# EAGLE design board 2.1 (EAGLE 9.6.2)
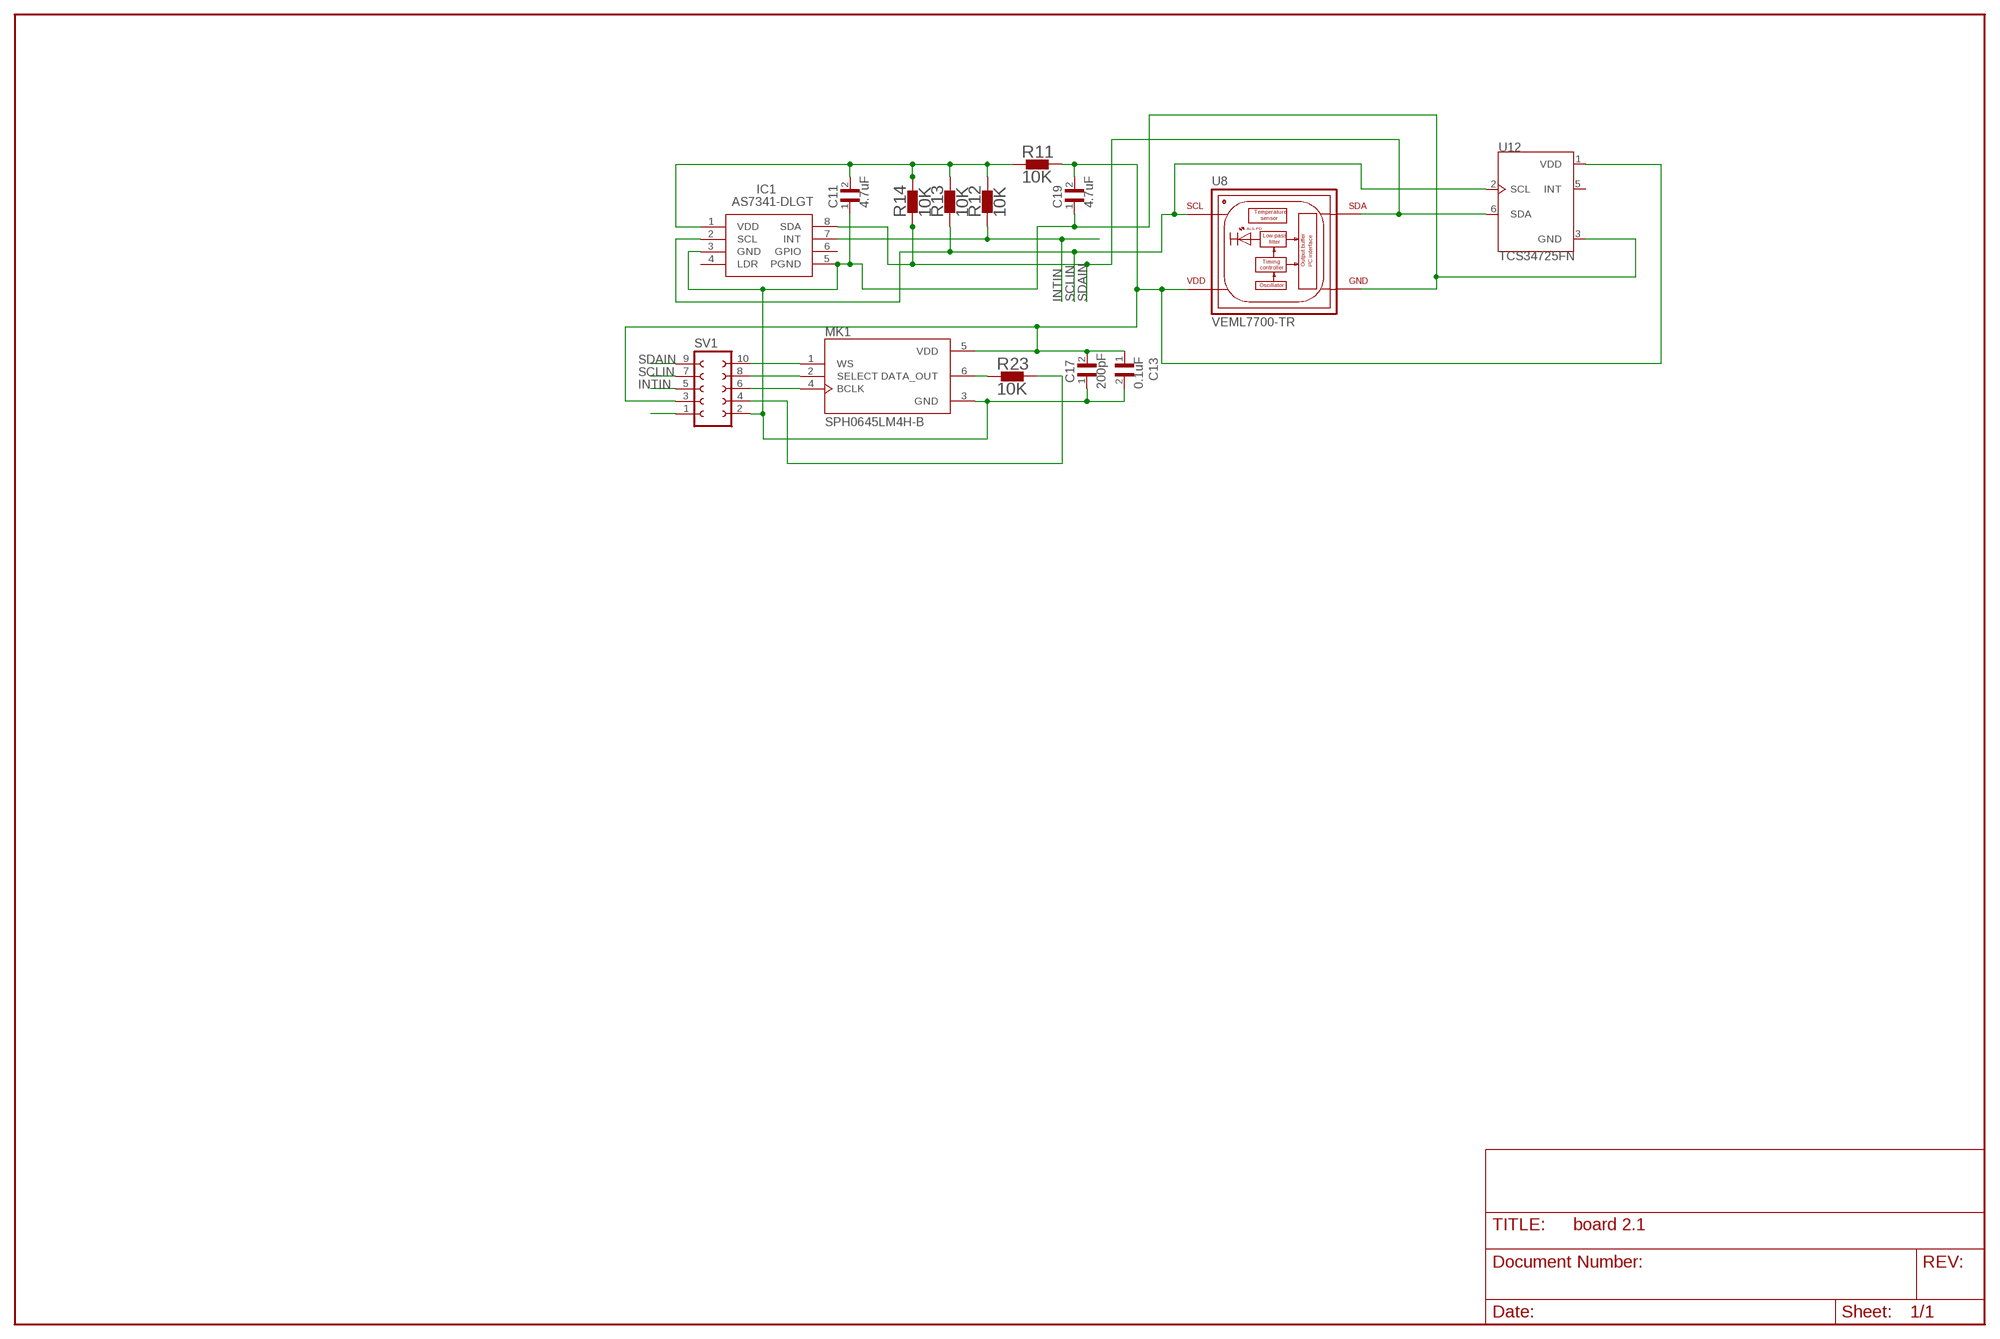
[diagram p0: schematic, sheet 1]

## Parts
C11  4.7uF  CL10A475KQ8NNNC  [CAPC1608X90N]
C13  0.1uF  CL05A104KA5NNNC  [CAPC1005X55N]
C17  200pF  CL10B102KB8NNNC  [CAPC1608X90N]
C19  4.7uF  CL10A475KQ8NNNC  [CAPC1608X90N]
IC1  AS7341-DLGT  [AS7341DLGT]
MK1  SPH0645LM4H-B  [MIC_SPH0645LM4H-B]
R11  10K  ERJ-P06F1002V  [RESC2012X70N]
R12  10K  ERJ-P06F1002V  [RESC2012X70N]
R13  10K  ERJ-P06F1002V  [RESC2012X70N]
R14  10K  ERJ-P06F1002V  [RESC2012X70N]
R23  10K  ERJ-P06F1002V  [RESC2012X70N]
SV1  FE05-2  [FE05-2]
U8  VEML7700-TR  [XDCR_VEML7700-TR]
U12  TCS34725FN  [SON65P200X240X70-6N]

## Nets
GND: C11.1 C13.2 C17.1 C19.1 IC1.3(GND) IC1.5(PGND) MK1.3(GND) SV1.2 U8.3(GND) U12.3(GND)
INTIN: IC1.7(INT) R12.1 SV1.5
N$7: MK1.6(DATA_OUT) R23.1
N$12: C13.1 C17.2 C19.2 MK1.5(VDD) R11.2 SV1.3 U8.2(VDD) U12.1(VDD)
N$13: R23.2 SV1.4
N$15: MK1.1(WS) SV1.10
N$16: MK1.2(SELECT) SV1.8
N$17: MK1.4(BCLK) SV1.6
N$18: C11.2 IC1.1(VDD) R11.1 R12.2 R13.2 R14.2
N$22: SV1.1
SCLIN: IC1.2(SCL) R13.1 SV1.7 U8.1(SCL) U12.2(SCL)
SDAIN: IC1.8(SDA) R14.1 SV1.9 U8.4(SDA) U12.6(SDA)
Unconnected: IC1.4(LDR) IC1.6(GPIO) U12.5(INT)

## Library data of the parts
C11 C19 = CL10A475KQ8NNNC:CL10A475KQ8NNNC: Cap Ceramic 4.7uF 6.3V X5R 10% Pad SMD 0603 85C T/R; DESCRIPTION: 4.7µF ±10% 6.3V Ceramic Capacitor X5R 0603 (1608 Metric); DIGI-KEY_PART_NUMBER: 1276-1045-1-ND; MF: Samsung Electro-Mechanics; MP: CL10A475KQ8NNNC; PACKAGE: 0603 Samsung; PURCHASE-URL: https://pricing.snapeda.com/search/part/CL10A475KQ8NNNC/?ref=eda
C13 = CL05A104KA5NNNC:CL05A104KA5NNNC: Capacitor [Samsung] CL05A104KA5NNNC Capacitor; DESCRIPTION: 0.1µF ±10% 25V Ceramic Capacitor X5R 0402 (1005 Metric); DIGI-KEY_PART_NUMBER: 1276-1043-1-ND; MF: Samsung Electro-Mechanics; MP: CL05A104KA5NNNC; PACKAGE: 0402 Samsung; PURCHASE-URL: https://pricing.snapeda.com/search/part/CL05A104KA5NNNC/?ref=eda
C17 = CL10B102KB8NNNC:CL10B102KB8NNNC: Capacitor: ceramic; MLCC; 1nF; 50V; X7R; ±10%; SMD; 0603; -55÷125°C; DESCRIPTION: 1000pF ±10% 50V Ceramic Capacitor X7R 0603 (1608 Metric); DIGI-KEY_PART_NUMBER: 1276-1018-1-ND; MF: Samsung; MP: CL10B102KB8NNNC; PACKAGE: 0603 Samsung; PURCHASE-URL: https://pricing.snapeda.com/search/part/CL10B102KB8NNNC/?ref=eda
IC1 = AS7341-DLGT:AS7341-DLGT: Ambient Light Sensors AS7341-DLGT OLGA8 LF T&RDP Source: Datasheet <https://www.mouser.com/catalog/specsheets/AMS_03152019_AS7341_DS000504_1-00.pdf>; ARROW_PART_NUMBER: AS7341-DLGT; ARROW_PRICE-STOCK: https://www.arrow.com/en/products/as7341-dlgt/ams-ag; DESCRIPTION: Ambient Light Sensors AS7341-DLGT OLGA8 LF T&RDP; HEIGHT: 1.1mm; MANUFACTURER_NAME: ams; MANUFACTURER_PART_NUMBER: AS7341-DLGT; MOUSER_PART_NUMBER: 985-AS7341-DLGT; MOUSER_PRICE-STOCK: https://www.mouser.co.uk/ProductDetail/ams/AS7341-DLGT/?qs=byeeYqUIh0Mv1a0BhdN%2FNw%3D%3D
MK1 = SPH0645LM4H-B:SPH0645LM4H-B: Mic Mems Digital I2s Omni -26db; DESCRIPTION: 20Hz ~ 10kHz Digital, I²S Microphone MEMS (Silicon) 1.62V ~ 3.6V Omnidirectional (-26dB ±3dB @ 94dB SPL) Solder Pads; DIGI-KEY_PART_NUMBER: 423-1405-1-ND; MF: Knowles; MP: SPH0645LM4H-B; PACKAGE: SIP-7 Bourns; PURCHASE-URL: https://pricing.snapeda.com/search/part/SPH0645LM4H-B/?ref=eda
R11-R14 R23 = ERJ-P06F1002V:ERJ-P06F1002V: Surface Mount Chip Resistor, Thick Film, AEC-Q200 ERJ Series, 10 kohm, 500 mW, 1%, 400 V; DESCRIPTION: 10 kOhms ±1% 0.5W, 1/2W Chip Resistor 0805 (2012 Metric) Automotive AEC-Q200, Pulse Withstanding Thick Film; DIGI-KEY_PART_NUMBER: P16059CT-ND; MF: Panasonic; MP: ERJ-P06F1002V; PACKAGE: 2012 Panasonic Electronic Components; PURCHASE-URL: https://pricing.snapeda.com/search/part/ERJ-P06F1002V/?ref=eda
SV1 = con-lsta:FE05-2: FEMALE HEADER; OC_FARNELL: unknown; OC_NEWARK: unknown
U8 = VEML7700-TR:VEML7700-TR: Light to Digital Ambient Light Sensor Digital 0lux to 167000lux 8-Pin SMD T/R Check prices <https://pricing.snapeda.com/parts/VEML7700-TR/Vishay/view-part?ref=eda>; AVAILABILITY: In Stock; DESCRIPTION: Optical Sensor Ambient 545nm I²C 4-SMD, J-Lead; MF: Vishay; MP: VEML7700-TR; PACKAGE: SMD-4 Vishay; PRICE: None; PURCHASE-URL: https://pricing.snapeda.com/search/part/VEML7700-TR/?ref=eda
U12 = TCS34725FN:TCS34725FN: Color Light To Digital with IR Filter Check prices <https://pricing.snapeda.com/parts/TCS34725FN/ams/view-part?ref=eda>; AVAILABILITY: In Stock; DESCRIPTION: Color Sensor 16 b Gain Control, Interrupt, Sleep Mode 6-SMD Module; MF: ams; MP: TCS34725FN; PACKAGE: SMD-6 ams; PRICE: None; PURCHASE-URL: https://pricing.snapeda.com/search/part/TCS34725FN/?ref=eda

## Board
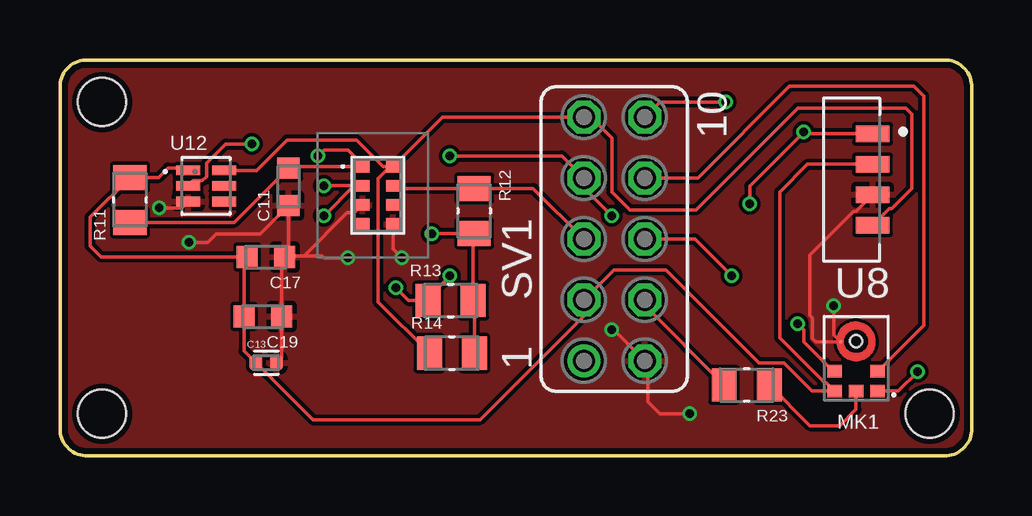
[diagram p1: board, top side]
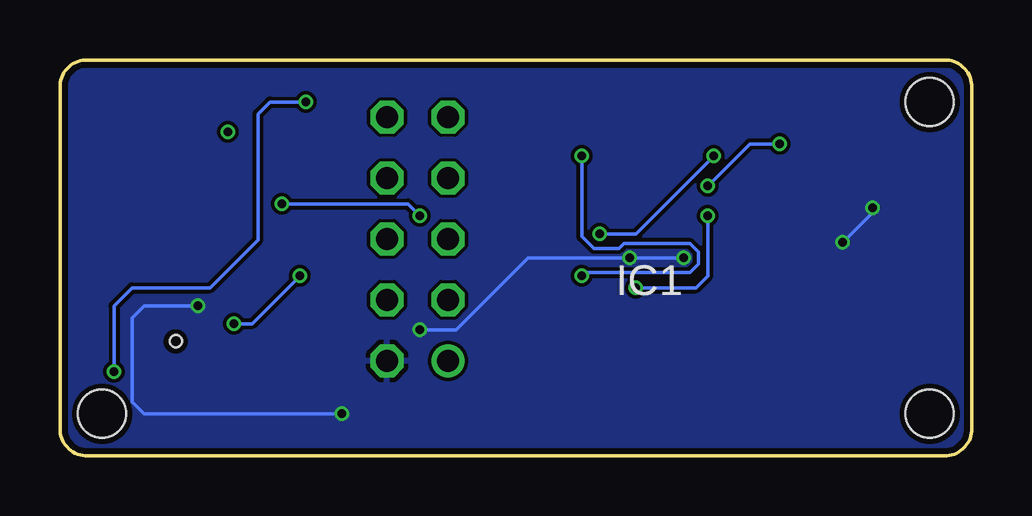
[diagram p2: board, bottom side, seen from below]

Size 38.01 x 16.51 mm. Coordinates in mm from the lower left corner, seen from the top.
Outline: 0.01,15.26 0.01,1.26 arc103 1.26,0.01 36.76,0.01 arc103 38.01,1.26 38.01,15.26 arc103 36.76,16.51 1.26,16.51 arc103 0.01,15.26
Copper layers (1*16): Top 0.018mm / dielectric 1.55mm / Bottom 0.018mm
Design rules "eC_2Layer_PClass6_BaseCopperO18_eCDefault": minimum track width 0.15mm, minimum drill 0.35mm, track to track 0.15mm, track to pad 0.15mm, pad to pad 0.15mm, via to via 0.15mm, smd to smd 0mil, copper to edge 0.25mm, drill to drill 0.35mm, minimum pad ring 0.175mm, minimum via ring 0.125mm, stop-mask expansion 0mil, vias tented up to drill 0.45mm, thermal gap 0.2mm
Holes 2 mm at 1.76,1.76 1.76,14.76 36.26,1.76

### Footprints (pad centres in the part's own frame; a part is rotated, then mirrored left to right if it is on the bottom)
CAPC1608X90N = smd 0.87 x 0.93: 1 -0.78,0; 2 0.78,0
CAPC1005X55N = smd 0.54 x 0.6: 1 -0.43,0; 2 0.43,0
AS7341DLGT = smd 0.575 x 0.488: 1 -0.638,1.2; 2 -0.638,0.4; 3 -0.638,-0.4; 4 -0.638,-1.2; 5 0.638,-1.2; 6 0.638,-0.4; 7 0.638,0.4; 8 0.638,1.2
MIC_SPH0645LM4H-B = smd 0.6 x 0.522: 1 -0.9,2.074; 2 -0.9,1.252; 4 0.9,1.252; 5 0.9,2.074; 6 0,2.074 | smd 0.1 x 0.1: 3 0.65,0.02 | hole 0.5: 0,0
RESC2012X70N = smd 1.04 x 1.38: 1 -0.94,0; 2 0.94,0
FE05-2 = drill 0.914: 1 -5.08,1.27 | drill 0.914 octagon: 2 -5.08,-1.27; 3 -2.54,1.27; 4 -2.54,-1.27; 5 0,1.27; 6 0,-1.27; 7 2.54,1.27; 8 2.54,-1.27; 9 5.08,1.27; 10 5.08,-1.27
XDCR_VEML7700-TR = smd 1.4 x 0.7: 1 0.55,1.905; 2 0.55,0.635; 3 0.55,-0.635; 4 0.55,-1.905
SON65P200X240X70-6N = smd 1 x 0.4: 1 -0.75,0.65; 2 -0.75,0; 3 -0.75,-0.65; 4 0.75,-0.65; 5 0.75,0; 6 0.75,0.65

### Placement (x,y rotation side)
C11  9.53,11.23 90 top
C13  8.6,3.89 0 top
C17  8.59,8.3 180 top
C19  8.46,5.82 180 top
IC1  13.25,10.87 0 top
MK1  33.19,4.78 180 top
R11  2.92,10.68 90 top
R12  17.27,10.22 270 top
R13  16.29,6.48 0 top
R14  16.34,4.29 0 top
R23  28.63,2.96 180 top
SV1  23.11,9.05 90 top
U8  33.33,11.53 0 top
U12  6.09,11.26 0 top

### Tracks (layer width: path | path; a pad name or v marks a point on that pad's centre or on a via)
GND  (via drill 0.35)
  Top 0.152: C13.2 9.24,4.1 C19.1 9.24,8.17 C17.1 9.42,8.35 | U8.3 33.19,10.2 33.08,10.2 31.26,8.37 31.26,5.86 31.36,5.76 31.36,4.9 31.51,4.76 MK1.3 32.26,5.04 v32.26,6.26 | 9.42,8.35 9.53,8.46 C11.1 8.34,9.26 6.51,9.26 6.15,8.9 v5.38,8.9 | IC1.3 12.28,10.14 11.98,10.14 10.18,8.35 | 10.18,8.35 9.42,8.35 | 10.18,8.35 10.92,8.35 11.01,8.26 v12.01,8.26 | v14.26,8.26 13.88,8.63 IC1.5 | v4.14,10.34 5.07,10.34 U12.3 | v23.01,5.26 23.09,5.26 SV1.2 24.51,3.84 24.51,2.26 25.01,1.76 v26.26,1.76
  Bottom 0.152: v12.01,8.26 v14.26,8.26 18.51,8.26 21.51,5.26 v23.01,5.26 | v5.38,8.9 4.03,10.26 4.01,10.26 4.09,10.34 v4.14,10.34 | v26.26,1.76 34.51,1.76 35.01,2.26 35.01,5.76 34.51,6.26 v32.26,6.26
  pour Top: -0.49,17.01 -0.49,-0.74 38.26,-0.74 38.26,17.01
  pour Bottom: -0.49,17.01 -0.49,-0.74 2.01,-0.74 38.26,-0.74 38.26,17.01
INTIN
  Top 0.152: IC1.7 13.99,11.16 R12.1 19.73,11.16 SV1.5
N$7
  Top 0.152: R23.1 31.27,1.26 32.51,1.26 33.19,1.94 MK1.6
N$12
  Top 0.152: U12.1 5.24,12.01 4.51,12.01 4.12,11.62 R11.2 1.26,9.96 1.26,8.76 1.72,8.3 C17.2 7.68,8.17 C19.2 7.68,4.38 C13.1 10.55,1.51 17.51,1.51 21.84,5.84 SV1.3 23.09,7.76 25.26,7.76 29.14,3.88 30.18,3.88 31.35,2.7 MK1.5 | MK1.5 31.95,3.03 31.89,3.03 30.01,4.92 30.01,11.01 31.16,12.16 U8.2 | MK1.5 31.98,3.01
N$13
  Top 0.152: R23.2 24.38,6.27 SV1.4
N$15  (via drill 0.35)
  Top 0.152: MK1.1 34.95,2.7 v35.76,3.51 | SV1.10 25.01,14.76 v27.76,14.76
  Bottom 0.152: v35.76,3.51 35.76,6.26 35.01,7.01 31.76,7.01 29.76,9.01 29.76,14.26 29.26,14.76 v27.76,14.76
N$16
  Top 0.152: MK1.2 36.01,5.44 36.01,15.01 35.6,15.41 30.41,15.41 26.59,11.59 SV1.8
N$17  (via drill 0.35)
  Top 0.152: SV1.6 26.47,9.05 v28.01,7.51 | v30.76,5.51 31.01,5.26 31.01,4.76 32.24,3.52 MK1.4
  Bottom 0.152: v28.01,7.51 30.01,5.51 v30.76,5.51
N$18  (via drill 0.35)
  Top 0.152: R11.1 7.26,9.74 C11.2 9.59,12.07 IC1.1 12.61,12.15 12.01,12.76 11.01,12.76 v10.76,12.51 | R14.2 17.28,6.43 R13.2 17.23,9.24 R12.2 15.53,9.28 v15.51,9.26
  Bottom 0.152: v15.51,9.26 14.01,9.26 v10.76,12.51
SCLIN  (via drill 0.35)
  Top 0.152: v11.01,11.26 v11.02,11.27 IC1.2 12.27,11.27 v11.01,10.01 | v14.01,7.01 14.54,6.48 R13.1 15.35,6.6 v16.26,7.51 | U12.2 5.56,11.48 5.93,11.48 6.11,11.65 6.11,12.2 6.91,13.01 v8.01,13.01 | v16.26,12.51 20.92,12.51 SV1.7 21.84,11.18 v23.01,10.01 | U8.1 31.08,13.43 v31.01,13.51 28.76,11.26 v28.76,10.51
  Bottom 0.152: v14.01,7.01 11.51,7.01 11.01,7.51 v11.01,10.01 | v8.01,13.01 9.26,13.01 v11.01,11.26 | v16.26,12.51 16.26,9.15 15.76,8.65 14.72,8.65 14.51,8.86 11.76,8.86 11.4,8.51 11.4,8.01 11.76,7.65 16.11,7.65 v16.26,7.51 | v28.76,10.51 23.51,10.51 v23.01,10.01
SDAIN
  Top 0.152: U12.6 8.2,11.91 9.47,13.17 12.36,13.17 13.46,12.07 13.76,12.07 | 13.76,12.07 IC1.8 15.94,14.13 21.76,14.13 SV1.9 22.14,14.13 23.01,13.26 23.01,11.01 23.76,10.26 26.51,10.26 30.76,14.51 35.26,14.51 35.51,14.26 35.51,11.15 34.67,10.31 34.57,10.31 U8.4 | R14.1 13.26,6.43 13.26,11.57 13.76,12.07